# Altium project PIF_robot.PrjPcb
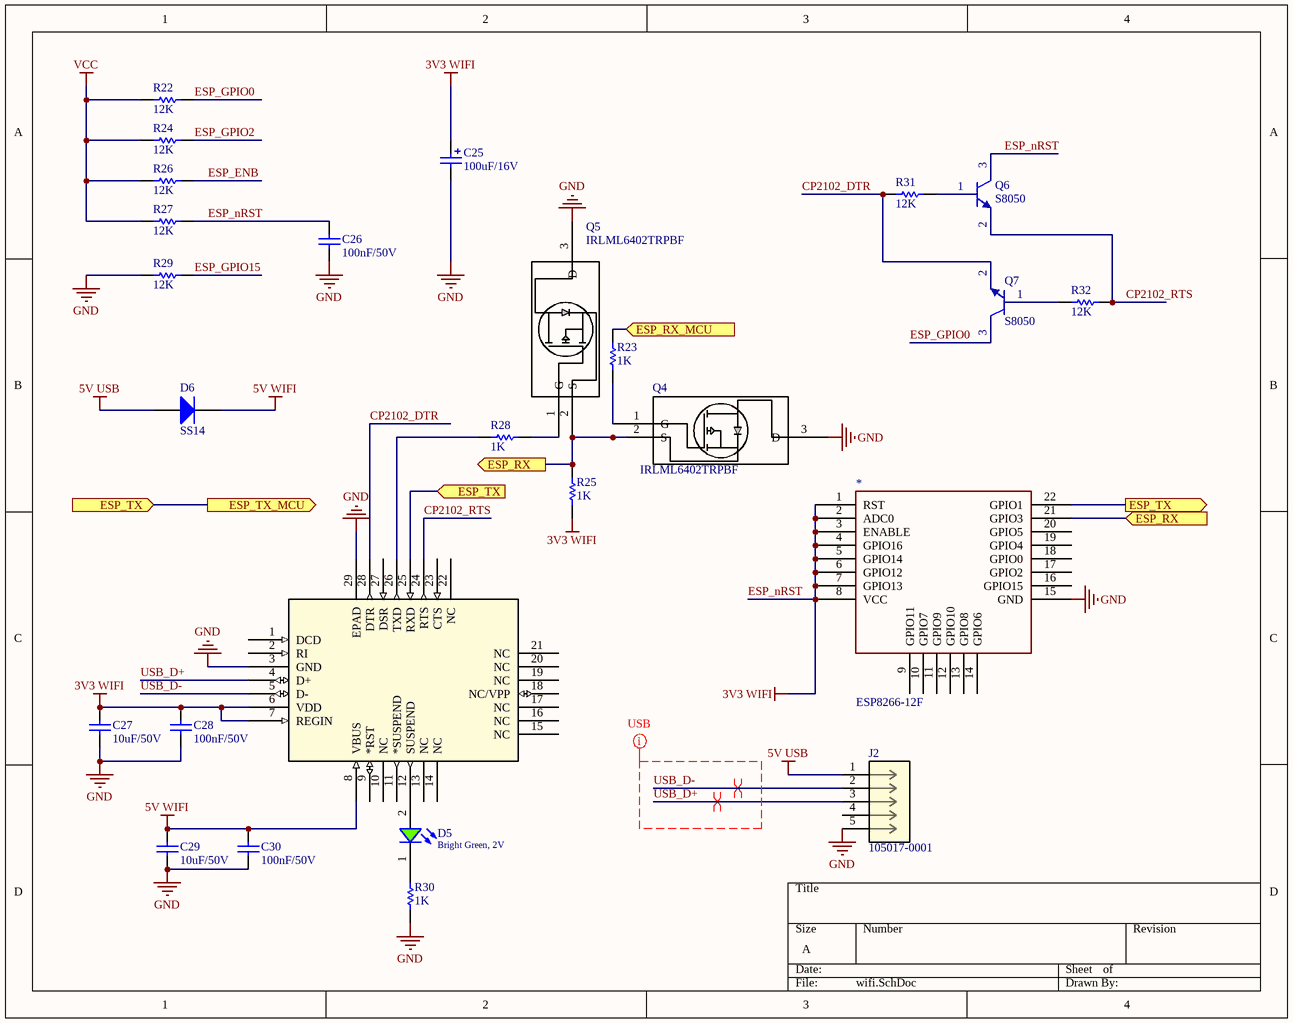
[diagram p0: wifi.SchDoc]
6 sheets, 91 parts. Net scope: flat (ports and power ports of the same name join across sheets).
Board file: PIF_robot.PcbDoc
Sheets:
  wifi.SchDoc
  Sensor.SchDoc
  RF.SchDoc
  Motor Control.SchDoc
  Decawave.schdoc
  MCU.schdoc

## Sheet wifi.SchDoc
size A

### Parts
*  ESP8266-12F  [ESP8266-12F]
?  (no value)  [QFN28_5X5_SIL]
C25  value 100uF/16V  [CAP_SM_TAN]  (hidden comment: TAJB107M006RNJ)
C26  value 100nF/50V  [CAP-SM-0805]  (hidden comment: Cap-100nF-50V-0805)
C27  value 10uF/50V  [CAP-SM-0805]  (hidden comment: Cap-10uF-50V-0805)
C28  value 100nF/50V  [CAP-SM-0805]  (hidden comment: Cap-100nF-50V-0805)
C29  value 10uF/50V  [CAP-SM-0805]  (hidden comment: Cap-10uF-50V-0805)
C30  value 100nF/50V  [CAP-SM-0805]  (hidden comment: Cap-100nF-50V-0805)
D5  Bright Green, 2V  [WL-SMCW_0805]
D6  SS14  [SS14]
J2  105017-0001  [CONN_105017-0001]
Q4  IRLML6402TRPBF  [SOT23_INF]
Q5  IRLML6402TRPBF  [SOT23_INF]
Q6  S8050  [SOT23_NEX]
Q7  S8050  [SOT23_NEX]
R22  value 12K  [RES-SM-0805]  (hidden comment: Res-12K-0805)
R23  value 1K  [RES-SM-0805]  (hidden comment: Res-1K-0805)
R24  value 12K  [RES-SM-0805]  (hidden comment: Res-12K-0805)
R25  value 1K  [RES-SM-0805]  (hidden comment: Res-1K-0805)
R26  value 12K  [RES-SM-0805]  (hidden comment: Res-12K-0805)
R27  value 12K  [RES-SM-0805]  (hidden comment: Res-12K-0805)
R28  value 1K  [RES-SM-0805]  (hidden comment: Res-1K-0805)
R29  value 12K  [RES-SM-0805]  (hidden comment: Res-12K-0805)
R30  value 1K  [RES-SM-0805]  (hidden comment: Res-1K-0805)
R31  value 12K  [RES-SM-0805]  (hidden comment: Res-12K-0805)
R32  value 12K  [RES-SM-0805]  (hidden comment: Res-12K-0805)

### Ports
ESP_RX (in), ESP_RX (out), ESP_RX_MCU (in), ESP_TX (in), ESP_TX (out), ESP_TX_MCU (out)

### Nets
5V USB: D6.2(A) J2.1
5V WIFI: ?.8(VBUS) C29.2 C30.2 D6.1(K)
ESP_nRST: *.1(RST) *.2(ADC0) *.3(ENABLE) *.4(GPIO16) *.5(GPIO14) *.6(GPIO12) *.7(GPIO13) *.8(VCC) ?.6(VDD) ?.7(REGIN) C25.1 C26.2 C27.2 C28.2 Q6.3(C) R25.1 R27.2  [also labelled 3V3 WIFI]
GND: *.15(GND) ?.3(GND) ?.29(EPAD) C25.2 C26.1 C27.1 C28.1 C29.1 C30.1 J2.5 Q4.3(D) Q5.3(D) R29.1 R30.1
VCC: R22.1 R24.1 R26.1 R27.1
CP2102_DTR: ?.28(DTR) Q7.2(E) R31.1
CP2102_RTS: ?.24(RTS) Q6.2(E) R32.2
ESP_ENB: R26.2
ESP_GPIO0: Q7.3(C) R22.2
ESP_GPIO2: R24.2
ESP_GPIO15: R29.2
USB_D+: ?.4(D+) J2.3
USB_D-: ?.5(D-) J2.2
Net*_21: *.21(GPIO3) Q4.2(S) Q5.2(S) R25.2 ; port ESP_RX
Net*_22: *.22(GPIO1) ?.25(RXD) ; port ESP_TX, port ESP_TX_MCU
Net?_12: ?.12(SUSPEND) D5.2(A)
Net?_26: ?.26(TXD) R28.1
NetD5_1: D5.1(K) R30.2
NetQ4_1: Q4.1(G) R23.2
NetQ5_1: Q5.1(G) R28.2
NetQ6_1: Q6.1(B) R31.2
NetQ7_1: Q7.1(B) R32.1
NetR23_1: R23.1 ; port ESP_RX_MCU

Not connected (* = marked no-connect by the designer): * 9(GPIO11) 10(GPIO7) 11(GPIO9) 12(GPIO10) 13(GPIO8) 14(GPIO6) 16(GPIO15) 17(GPIO2) 18(GPIO0) 19(GPIO4) 20(GPIO5); ? 1(DCD) 2(RI) 9(*RST) 10(NC) 11(*SUSPEND) 13(NC) 14(NC) 15(NC) 16(NC) 17(NC) 18(NC/VPP) 19(NC) 20(NC) 21(NC) 22(NC) 23(CTS) 27(DSR); J2 4

### Layout directives
differential pair: USB_D+, USB_D-
mark named USB: USB_D+, USB_D-

### Library data of the parts
? = CP2102-GM: No Description Available; Vendor: Silicon Labs; Built_By: EMA_UL_Team; SourceLibrary: Silicon_Labs_2015-03-23; Manufacturer_Part_Number: CP2102-GM; Copyright: Copyright (C) 2018 Accelerated Designs. All rights reserved; RefDes: RefDes; Type: DEV
C25 = Cap-Tan-100uF-16V: Manufacturer: Nichicon; Manufacturer Part Number: UWX1C101MCL1GB; Local Supplier: icdayroi; Local Supplier Link: https://icdayroi.com/tu-tantalum-100uf-16v-smd6032; Supplier 1: Digikey; Supplier 1 Part Number: 493-2105-1-ND; Supplier 1 Link: https://www.digikey.com/product-detail/en/nichicon/UWX1C101MCL1GB/493-2105-1-ND/590080
C26 C28 C30 = Cap-100nF-50V-0805: CAP CER 0.1UF 50V Y5V 0805; Manufacturer: Samsung Electro-Mechanics; Manufacturer Part Number: CL21F104ZBCNNNC; Local Supplier: thegioiic; Local Supplier Link: https://thegioiic.com/products/tu-100nf-0-1uf-50v-0805; Supplier 1: Digikey; Supplier 1 Part Number: 1276-1007-1-ND; Supplier 1 Link: https://www.digikey.com/product-detail/en/samsung-electro-mechanics/CL21F104ZBCNNNC/1276-1007-1-ND/3889093
C27 C29 = Cap-10uF-50V-0805: CAP CER 10UF 50V X5R 0805; Manufacturer: Yageo; Manufacturer Part Number: CC0805KKX5R9BB106; Local Supplier: thegioiic; Local Supplier Link: https://thegioiic.com/products/tu-10uf-50v-0805; Supplier 1: Digikey; Supplier 1 Link: https://www.digikey.com/product-detail/en/yageo/CC0805KKX5R9BB106/311-3499-2-ND/7164383; Supplier 1 Part Number: 311-3499-2-ND
D5 = 150080VS75000: WL-SMCW SMT Mono-color Chip LED Waterclear, size 0805, Bright Green, 2V, 140deg; Chip Technology: AlInGaP; Dominant Wavelength typ.: 570nm; Luminous Intensity typ.: 40mcd; Peak Wavelength typ.: 572nm; Viewing Angle: 140deg; ComponentLink1Description: Manufacturer; ComponentLink1URL: http://www.we-online.de; ComponentLink2URL: https://www.we-online.com/catalog/datasheet/150080VS75000.pdf; ComponentLink2Description: Datasheet; Forward Voltage typ.: 2V; Emitting Color: Bright Green; Mounting Technology: SMT; Operating Temperature: -40 to +85degC; Published Date: December 2019; Part Number: 150080VS75000; Packaging: Tape and Reel; Size: 0805; Publisher: Wurth Elektronik
D6 = Diode-SS14: DIODE SCHOTTKY 40V 1A SMA; Manufacturer: ON Semiconductor; Local Supplier: thegioiic; Local Supplier Link: https://thegioiic.com/products/ss14-sma; Supplier 1: Digikey; Supplier 1 Link: https://www.digikey.com/product-detail/en/on-semiconductor/SS14/SS14CT-ND/965729; Manufacturer Part Number: SS14; Supplier 1 Part Number: SS14CT-ND
J2 = 105017-0001: No Description Available; Vendor: Molex Connector Corporation; Built_By: EMA_Cory; SourceLibrary: Molex_2020-05-26; Datasheet: https://www.molex.com/pdm_docs/sd/1050170001_sd.pdf; Manufacturer_Part_Number: 105017-0001; Copyright: Copyright (C) 2018 Accelerated Designs. All rights reserved; RefDes: RefDes; Type: DEV
Q4 Q5 = IRLML6402TRPBF: No Description Available; Source_Library: Infineon_2020-02-27.xlr; Built_By: EMA_Justin; SourceLibrary: Infineon_2020-02-27; Vendor: Infineon; Type: DEV; Copyright: Copyright (C) 2018 Accelerated Designs. All rights reserved; Manufacturer_Part_Number: IRLML6402TRPBF; RefDes: RefDes
R22 R24 R26 R27 R29 R31 R32 = Res-12K-0805: RES 12 KOHM JUMPER 0805; Manufacturer: Vishay Thin Film; Manufacturer Part Number: PAT0805E3121BST1; Local Supplier: icdayroi; Local Supplier Link: https://icdayroi.com/dien-tro-12k-0805-1-goi-50-con; Supplier 1: Digikey; Supplier 1 Link: https://www.digikey.com/product-detail/en/vishay-thin-film/PAT0805E3121BST1/PAT0805E3121BST1-ND/2281536; Supplier 1 Part Number: PAT0805E3121BST1-ND
R23 R25 R28 R30 = Res-1K-0805: RES 1K OHM 1% 1/4W 0805; Manufacturer: Stackpole Electronics Inc; Manufacturer Part Number: RNCP0805FTD1K00; Local Supplier: thegioiic; Local Supplier Link: https://thegioiic.com/products/dien-tro-1k-ohm-0805-5; Supplier 1: Digikey; Supplier 1 Link: https://www.digikey.com/product-detail/en/stackpole-electronics-inc/RNCP0805FTD1K00/RNCP0805FTD1K00CT-ND/2240568; Supplier 1 Part Number: RNCP0805FTD1K00CT-ND
* = ESP8266-12F: Local Supplier: HShop; Local Supplier Link: https://hshop.vn/products/mach-thu-phat-wifi-soc-esp8266-v12; Local Supplier Part Number: HS000912; Manufacturer: *; Manufacturer Part Number: *

## Sheet Sensor.SchDoc
size A
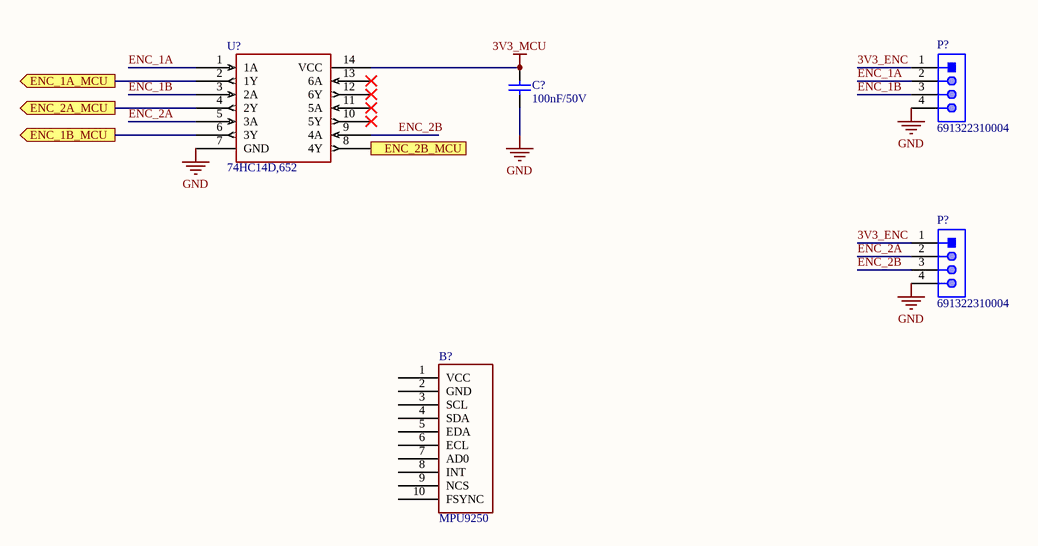
[diagram p1: Sensor.SchDoc]

### Parts
(Parts that share a designator on the sheet are numbered #1, #2 ... from top to bottom, then left to right.)
B?  MPU9250  [MPU9250]
C?#1  value 100nF/50V  [CAP-SM-0805]  (hidden comment: Cap-100nF-50V-0805)
P?#1  691322310004  [691322310004]
P?#2  691322310004  [691322310004]
U?#1  74HC14D,652  [SOT108-1_NEX]

### Ports
ENC_1A_MCU (out), ENC_1B_MCU (out), ENC_2A_MCU (out), ENC_2B_MCU (out)

### Nets
3V3_MCU: C?#1.2 U?#1.14(VCC)
GND: C?#1.1 P?#1.4 P?#2.4 U?#1.7(GND)
3V3_ENC: P?#1.1 P?#2.1
ENC_1A: P?#1.2 U?#1.1(1A)
ENC_1B: P?#1.3 U?#1.3(2A)
ENC_2A: P?#2.2 U?#1.5(3A)
ENC_2B: P?#2.3 U?#1.9(4A)
NetU?#1_2: U?#1.2(1Y) ; port ENC_1A_MCU
NetU?#1_4: U?#1.4(2Y) ; port ENC_2A_MCU
NetU?#1_6: U?#1.6(3Y) ; port ENC_1B_MCU
NetU?#1_8: U?#1.8(4Y) ; port ENC_2B_MCU

Not connected (* = marked no-connect by the designer): B? 1(VCC) 2(GND) 3(SCL) 4(SDA) 5(EDA) 6(ECL) 7(AD0) 8(INT) 9(NCS) 10(FSYNC); U?#1 10(5Y)* 11(5A)* 12(6Y)* 13(6A)*

### Library data of the parts
C?#1 = Cap-100nF-50V-0805: as C26 on sheet wifi; Local Supplier: thegioiic; Local Supplier Link: https://thegioiic.com/products/tu-100nf-0-1uf-50v-0805; Supplier 1: Digikey; Supplier 1 Part Number: 1276-1007-1-ND; Supplier 1 Link: https://www.digikey.com/product-detail/en/samsung-electro-mechanics/CL21F104ZBCNNNC/1276-1007-1-ND/3889093
P?#1 P?#2 = 691322310004: WR-TBL Serie 322 Horizontal PCB Header, Pluggable, pitch 3.81mm, 4p; Compliance: RoHS; Modularity: No; Pin Number: 4; Rated Current [UL]: 10A; Working Voltage [UL]: 300VAC; ComponentLink1Description: Manufacturer; ComponentLink1URL: http://www.we-online.de; ComponentLink2URL: https://katalog.we-online.de/em/datasheet/691322310004.pdf; ComponentLink2Description: Datasheet; Mounting Technology: THT; Part Number: 691322310004; Packaging: Box; Operating Temperature: -40 to +105degC; PCB/Cable/Panel: PCB; Pitch: 3.81mm; Published Date: October 2019; Type: Horizontal; Publisher: Wurth Elektronik; Application: Pluggable

## Sheet RF.SchDoc
size A
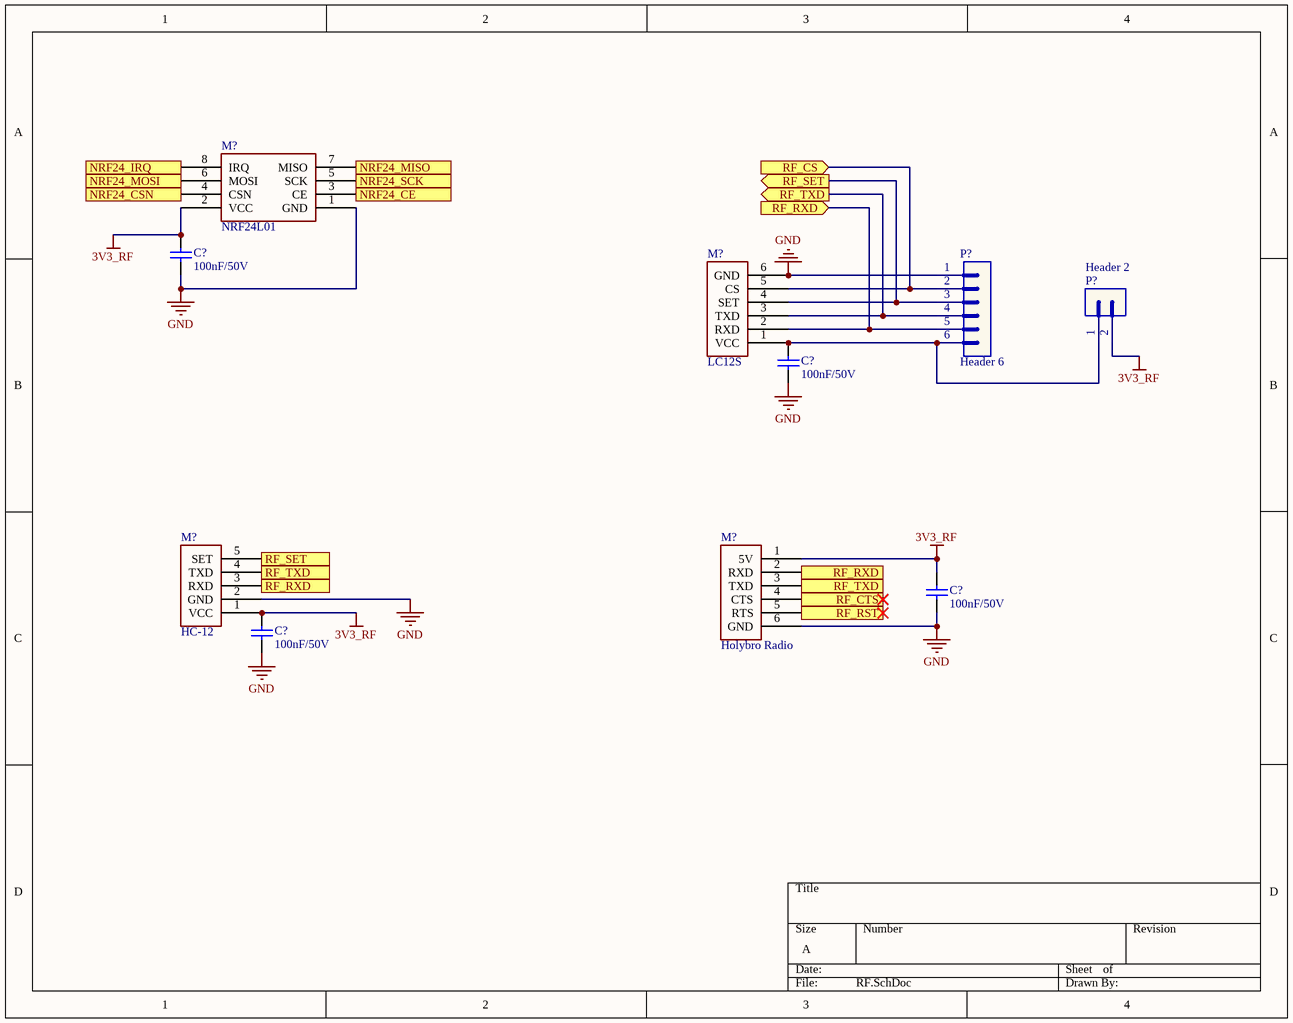
[diagram p2: RF.SchDoc]

### Parts
(Parts that share a designator on the sheet are numbered #1, #2 ... from top to bottom, then left to right.)
C?#2  value 100nF/50V  [CAP-SM-0805]  (hidden comment: Cap-100nF-50V-0805)
C?#3  value 100nF/50V  [CAP-SM-0805]  (hidden comment: Cap-100nF-50V-0805)
C?#4  value 100nF/50V  [CAP-SM-0805]  (hidden comment: Cap-100nF-50V-0805)
C?#5  value 100nF/50V  [CAP-SM-0805]  (hidden comment: Cap-100nF-50V-0805)
M?#1  NRF24L01  [NRF24L01]
M?#2  LC12S  [LC12S]
M?#3  HC-12  [HC-12]
M?#4  Holybro Radio  [Holybro-Radio]
P?#3  Header 6  [JP6]
P?#4  Header 2  [JP2]

### Ports
NRF24_CE (in), NRF24_CSN (in), NRF24_IRQ (out), NRF24_MISO (out), NRF24_MOSI (in), NRF24_SCK (in), RF_CS (in), RF_CTS (in), RF_RST (out), RF_RXD (in), RF_RXD (out), RF_SET (out), RF_TXD (in), RF_TXD (out)

### Nets
3V3_RF: C?#2.2 C?#4.2 C?#5.2 M?#1.2(VCC) M?#3.1(VCC) M?#4.1(5V) P?#4.2
GND: C?#2.1 C?#3.1 C?#4.1 C?#5.1 M?#1.1(GND) M?#2.6(GND) M?#3.2(GND) M?#4.6(GND) P?#3.1
NetC?#3_2: C?#3.2 M?#2.1(VCC) P?#3.6 P?#4.1
NetM?#1_3: M?#1.3(CE) ; port NRF24_CE
NetM?#1_4: M?#1.4(CSN) ; port NRF24_CSN
NetM?#1_5: M?#1.5(SCK) ; port NRF24_SCK
NetM?#1_6: M?#1.6(MOSI) ; port NRF24_MOSI
NetM?#1_7: M?#1.7(MISO) ; port NRF24_MISO
NetM?#1_8: M?#1.8(IRQ) ; port NRF24_IRQ
NetM?#2_2: M?#2.2(RXD) M?#3.3(RXD) M?#4.2(RXD) P?#3.5 ; port RF_RXD
NetM?#2_3: M?#2.3(TXD) M?#3.4(TXD) M?#4.3(TXD) P?#3.4 ; port RF_TXD
NetM?#2_4: M?#2.4(SET) M?#3.5(SET) P?#3.3 ; port RF_SET
NetM?#2_5: M?#2.5(CS) P?#3.2 ; port RF_CS
NetM?#4_4: M?#4.4(CTS) ; port RF_CTS
NetM?#4_5: M?#4.5(RTS) ; port RF_RST

### Library data of the parts
C?#2-C?#5 = Cap-100nF-50V-0805: as C26 on sheet wifi; Local Supplier: thegioiic; Local Supplier Link: https://thegioiic.com/products/tu-100nf-0-1uf-50v-0805; Supplier 1: Digikey; Supplier 1 Part Number: 1276-1007-1-ND; Supplier 1 Link: https://www.digikey.com/product-detail/en/samsung-electro-mechanics/CL21F104ZBCNNNC/1276-1007-1-ND/3889093
P?#3 = Header 6: Header, 6-Pin; LatestRevisionDate: 17-Jul-2002; LatestRevisionNote: Re-released for DXP Platform.; Publisher: Altium Limited
P?#4 = Header 2: Header, 2-Pin; LatestRevisionDate: 17-Jul-2002; LatestRevisionNote: Re-released for DXP Platform.; Publisher: Altium Limited
M?#1 = NRF24L01: Local Supplier Link: https://hshop.vn/products/mach-thu-phat-nrf24l01-pa-2-4ghzcu-khech-dai-cung-suat-thu-phat; Local Supplier: HShop; Local Supplier Part Number: HS000888; Manufacturer: *; Manufacturer Part Number: *
M?#2 = LC12S: Local Supplier Link: https://hshop.vn/products/mach-thu-phat-rf-uart-lc12s-2-4ghz?fbclid=IwAR3h1hU0io-Cc4GBL9Q-KMB_-TKtvE-b63OAEmRNHthVrXHliy_JpDId3Yg; Local Supplier: HShop; Local Supplier Part Number: HS00095; Manufacturer: *; Manufacturer Part Number: *
M?#3 = HC-12: Local Supplier: HShop; Local Supplier Link: https://hshop.vn/products/mach-thu-phat-rf-uart-si4463-433mhzkhoang-coch-1km; Local Supplier Part Number: HS000897; Manufacturer: *; Manufacturer Part Number: *
M?#4 = Holybro Radio: Local Supplier: *; Local Supplier Link: https://www.lazada.vn/products/ld-holybro-433mhz-915-mhz-500-mw-thu-phat-vo-tuyen-xa-bo-v3-cho-pixhawk-4-dieu-khien-chuyen-bay-i430804435-s768474304.html?spm=a2o4n.searchlist.list.4.25396b19yIS9XO&search=1; Local Supplier Part Number: *; Manufacturer: *; Manufacturer Part Number: *

## Sheet Motor Control.SchDoc
size A
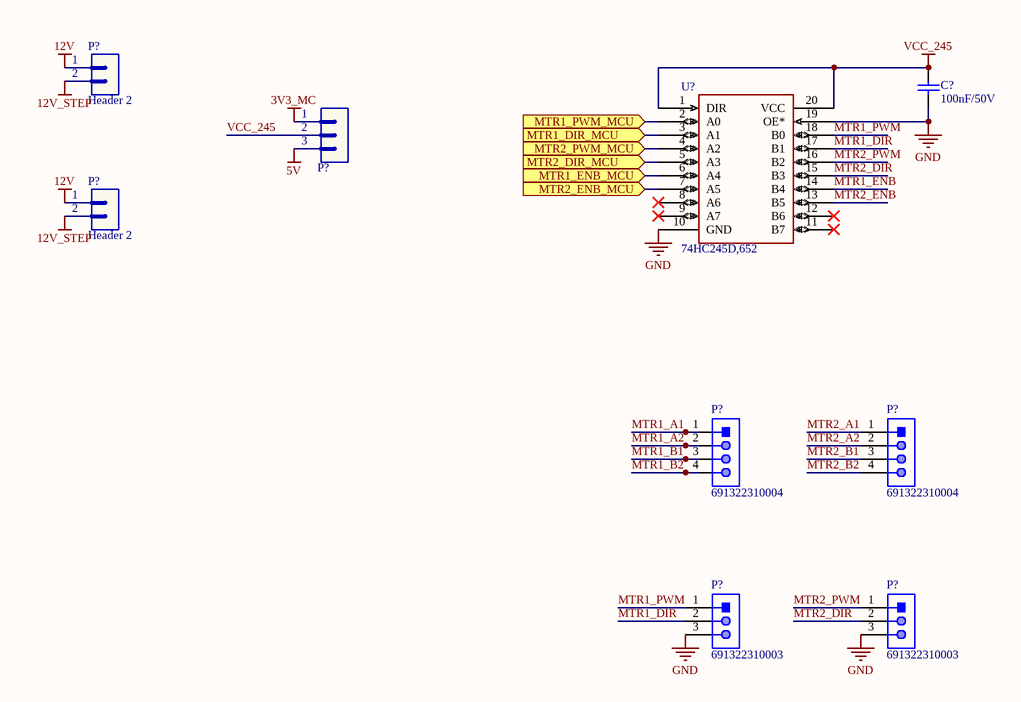
[diagram p3: Motor Control.SchDoc]

### Parts
(Parts that share a designator on the sheet are numbered #1, #2 ... from top to bottom, then left to right.)
C?#6  value 100nF/50V  [CAP-SM-0805]  (hidden comment: Cap-100nF-50V-0805)
P?#5  Header 2  [JP2]
P?#6  Header 3  [JP3]  (value not drawn)
P?#7  Header 2  [JP2]
P?#8  691322310004  [691322310004]
P?#9  691322310004  [691322310004]
P?#10  691322310003  [691322310003]
P?#11  691322310003  [691322310003]
U?#2  74HC245D,652  [SOT163-1_NEX]

### Ports
MTR1_DIR_MCU (in), MTR1_ENB_MCU (in), MTR1_PWM_MCU (in), MTR2_DIR_MCU (in), MTR2_ENB_MCU (in), MTR2_PWM_MCU (in)

### Nets
3V3_MC: P?#6.1
5V: P?#6.3
12V: P?#5.1 P?#7.1
12V_STEP: P?#5.2 P?#7.2
GND: C?#6.1 P?#10.3 P?#11.3 U?#2.10(GND) U?#2.19(OE*)
VCC_245: C?#6.2 P?#6.2 U?#2.1(DIR) U?#2.20(VCC)
MTR1_A1: P?#8.1
MTR1_A2: P?#8.2
MTR1_B1: P?#8.3
MTR1_B2: P?#8.4
MTR1_DIR: P?#10.2 U?#2.17(B1)
MTR1_ENB: U?#2.14(B4)
MTR1_PWM: P?#10.1 U?#2.18(B0)
MTR2_A1: P?#9.1
MTR2_A2: P?#9.2
MTR2_B1: P?#9.3
MTR2_B2: P?#9.4
MTR2_DIR: P?#11.2 U?#2.15(B3)
MTR2_ENB: U?#2.13(B5)
MTR2_PWM: P?#11.1 U?#2.16(B2)
NetU?#2_2: U?#2.2(A0) ; port MTR1_PWM_MCU
NetU?#2_3: U?#2.3(A1) ; port MTR1_DIR_MCU
NetU?#2_4: U?#2.4(A2) ; port MTR2_PWM_MCU
NetU?#2_5: U?#2.5(A3) ; port MTR2_DIR_MCU
NetU?#2_6: U?#2.6(A4) ; port MTR1_ENB_MCU
NetU?#2_7: U?#2.7(A5) ; port MTR2_ENB_MCU

Not connected (* = marked no-connect by the designer): U?#2 8(A6)* 9(A7)* 11(B7)* 12(B6)*

### Library data of the parts
C?#6 = Cap-100nF-50V-0805: as C26 on sheet wifi; Local Supplier: thegioiic; Local Supplier Link: https://thegioiic.com/products/tu-100nf-0-1uf-50v-0805; Supplier 1: Digikey; Supplier 1 Part Number: 1276-1007-1-ND; Supplier 1 Link: https://www.digikey.com/product-detail/en/samsung-electro-mechanics/CL21F104ZBCNNNC/1276-1007-1-ND/3889093
P?#5 P?#7 = Header 2: Header, 2-Pin; LatestRevisionDate: 17-Jul-2002; LatestRevisionNote: Re-released for DXP Platform.; Publisher: Altium Limited
P?#6 = Header 3: Header, 3-Pin; LatestRevisionDate: 17-Jul-2002; LatestRevisionNote: Re-released for DXP Platform.; Publisher: Altium Limited
P?#8 P?#9 = 691322310004: as P?#1 on sheet Sensor; ComponentLink1Description: Manufacturer; ComponentLink1URL: http://www.we-online.de; ComponentLink2URL: https://katalog.we-online.de/em/datasheet/691322310004.pdf; ComponentLink2Description: Datasheet; Mounting Technology: THT; Part Number: 691322310004; Packaging: Box; Operating Temperature: -40 to +105degC; PCB/Cable/Panel: PCB; Pitch: 3.81mm; Published Date: October 2019; Type: Horizontal; Publisher: Wurth Elektronik; Application: Pluggable
P?#10 P?#11 = 691322310003: WR-TBL Serie 322 Horizontal PCB Header, Pluggable, pitch 3.81mm, 3p; Compliance: RoHS; Modularity: No; Pin Number: 3; Rated Current [UL]: 10A; Working Voltage [UL]: 300VAC; ComponentLink1Description: Manufacturer; ComponentLink1URL: http://www.we-online.de; ComponentLink2URL: https://katalog.we-online.de/em/datasheet/691322310003.pdf; ComponentLink2Description: Datasheet; Mounting Technology: THT; Part Number: 691322310003; Packaging: Box; Operating Temperature: -40 to +105degC; PCB/Cable/Panel: PCB; Pitch: 3.81mm; Published Date: October 2019; Type: Horizontal; Publisher: Wurth Elektronik; Application: Pluggable

## Sheet Decawave.schdoc
size A
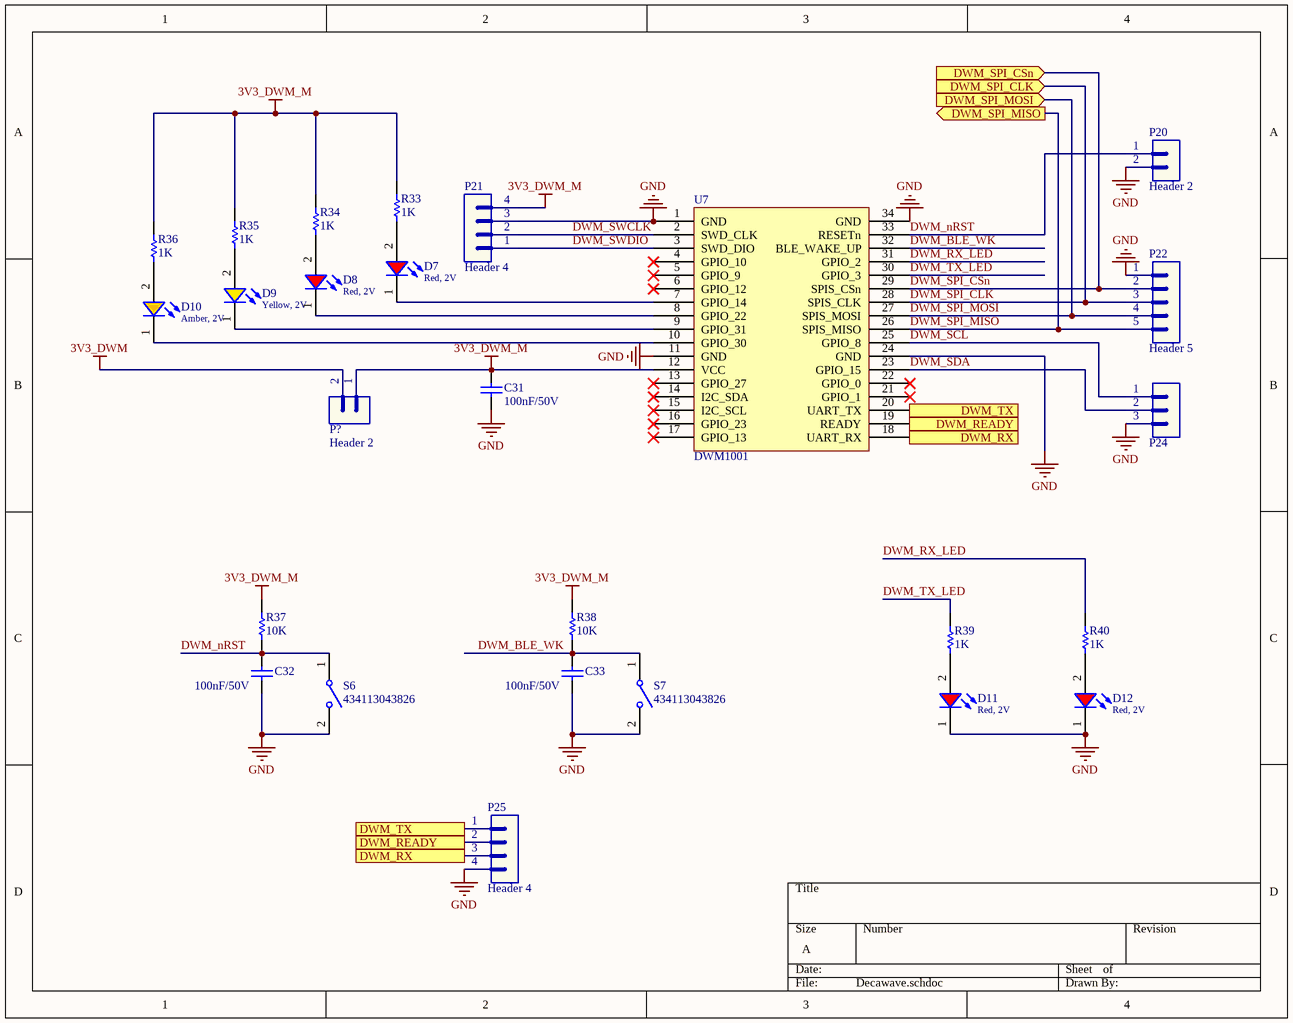
[diagram p4: Decawave.schdoc]

### Parts
(Parts that share a designator on the sheet are numbered #1, #2 ... from top to bottom, then left to right.)
C31  value 100nF/50V  [CAP-SM-0805]  (hidden comment: Cap-100nF-50V-0805)
C32  value 100nF/50V  [CAP-SM-0805]  (hidden comment: Cap-100nF-50V-0805)
C33  value 100nF/50V  [CAP-SM-0805]  (hidden comment: Cap-100nF-50V-0805)
D7  Red, 2V  [WL-SMCW_0805]
D8  Red, 2V  [WL-SMCW_0805]
D9  Yellow, 2V  [WL-SMCW_0805]
D10  Amber, 2V  [WL-SMCW_0805]
D11  Red, 2V  [WL-SMCW_0805]
D12  Red, 2V  [WL-SMCW_0805]
P20  Header 2  [JP2]
P21  Header 4  [JP4]
P22  Header 5  [JP5]
P24  Header 3  [JP3]  (value not drawn)
P25  Header 4  [JP4]
P?#12  Header 2  [JP2]
R33  value 1K  [RES-SM-0805]  (hidden comment: Res-1K-0805)
R34  value 1K  [RES-SM-0805]  (hidden comment: Res-1K-0805)
R35  value 1K  [RES-SM-0805]  (hidden comment: Res-1K-0805)
R36  value 1K  [RES-SM-0805]  (hidden comment: Res-1K-0805)
R37  value 10K  [RES-SM-0805]  (hidden comment: Res-10k-0805)
R38  value 10K  [RES-SM-0805]  (hidden comment: Res-10k-0805)
R39  value 1K  [RES-SM-0805]  (hidden comment: Res-1K-0805)
R40  value 1K  [RES-SM-0805]  (hidden comment: Res-1K-0805)
S6  434113043826  [434113043826]
S7  434113043826  [434113043826]
U7  DWM1001

### Ports
DWM_READY (in), DWM_READY (out), DWM_RX (in), DWM_RX (out), DWM_SPI_CLK (in), DWM_SPI_CSn (in), DWM_SPI_MISO (out), DWM_SPI_MOSI (in), DWM_TX (in), DWM_TX (out)

### Nets
3V3_DWM: P?#12.2
3V3_DWM_M: C31.2 P21.4 P?#12.1 R33.2 R34.2 R35.2 R36.2 R37.2 R38.2 U7.12(VCC)
GND: C31.1 C32.2 C33.2 D11.1(K) D12.1(K) P20.2 P21.3 P22.1 P24.3 P25.4 S6.2 S7.2 U7.1(GND) U7.11(GND) U7.24(GND) U7.34(GND)
DWM_BLE_WK: C33.1 R38.1 S7.1 U7.32(BLE_WAKE_UP)
DWM_nRST: C32.1 P20.1 R37.1 S6.1 U7.33(RESETn)
DWM_RX_LED: R40.2 U7.31(GPIO_2)
DWM_SCL: P24.1 U7.25(GPIO_8)
DWM_SDA: P24.2 U7.23(GPIO_15)
DWM_SPI_CLK: P22.3 U7.28(SPIS_CLK) ; port DWM_SPI_CLK
DWM_SPI_CSn: P22.2 U7.29(SPIS_CSn) ; port DWM_SPI_CSn
DWM_SPI_MISO: P22.5 U7.26(SPIS_MISO) ; port DWM_SPI_MISO
DWM_SPI_MOSI: P22.4 U7.27(SPIS_MOSI) ; port DWM_SPI_MOSI
DWM_SWCLK: P21.2 U7.2(SWD_CLK)
DWM_SWDIO: P21.1 U7.3(SWD_DIO)
DWM_TX_LED: R39.2 U7.30(GPIO_3)
NetD7_1: D7.1(K) U7.7(GPIO_14)
NetD7_2: D7.2(A) R33.1
NetD8_1: D8.1(K) U7.8(GPIO_22)
NetD8_2: D8.2(A) R34.1
NetD9_1: D9.1(K) U7.9(GPIO_31)
NetD9_2: D9.2(A) R35.1
NetD10_1: D10.1(K) U7.10(GPIO_30)
NetD10_2: D10.2(A) R36.1
NetD11_2: D11.2(A) R39.1
NetD12_2: D12.2(A) R40.1
NetP25_1: P25.1 U7.20(UART_TX) ; port DWM_TX
NetP25_2: P25.2 U7.19(READY) ; port DWM_READY
NetP25_3: P25.3 U7.18(UART_RX) ; port DWM_RX

Not connected (* = marked no-connect by the designer): U7 4(GPIO_10)* 5(GPIO_9)* 6(GPIO_12)* 13(GPIO_27)* 14(I2C_SDA)* 15(I2C_SCL)* 16(GPIO_23)* 17(GPIO_13)* 21(GPIO_1)* 22(GPIO_0)*

### Library data of the parts
C31-C33 = Cap-100nF-50V-0805: as C26 on sheet wifi; Local Supplier: thegioiic; Local Supplier Link: https://thegioiic.com/products/tu-100nf-0-1uf-50v-0805; Supplier 1: Digikey; Supplier 1 Part Number: 1276-1007-1-ND; Supplier 1 Link: https://www.digikey.com/product-detail/en/samsung-electro-mechanics/CL21F104ZBCNNNC/1276-1007-1-ND/3889093
D7 D8 D11 D12 = 150080RS75000: WL-SMCW SMT Mono-color Chip LED Waterclear, size 0805, Red, 2V, 140deg; Chip Technology: AlInGaP; Dominant Wavelength typ.: 625nm; Luminous Intensity typ.: 150mcd; Peak Wavelength typ.: 630nm; Viewing Angle: 140deg; ComponentLink1Description: Manufacturer; ComponentLink1URL: http://www.we-online.de; ComponentLink2URL: https://www.we-online.com/catalog/datasheet/150080RS75000.pdf; ComponentLink2Description: Datasheet; Forward Voltage typ.: 2V; Emitting Color: Red; Mounting Technology: SMT; Operating Temperature: -40 to +85degC; Published Date: December 2019; Part Number: 150080RS75000; Packaging: Tape and Reel; Size: 0805; Publisher: Wurth Elektronik
D9 = 150080YS75000: WL-SMCW SMT Mono-color Chip LED Waterclear, size 0805, Yellow, 2V, 140deg; Chip Technology: AlInGaP; Dominant Wavelength typ.: 590nm; Luminous Intensity typ.: 120mcd; Peak Wavelength typ.: 595nm; Viewing Angle: 140deg; ComponentLink1Description: Manufacturer; ComponentLink1URL: http://www.we-online.de; ComponentLink2URL: https://www.we-online.com/catalog/datasheet/150080YS75000.pdf; ComponentLink2Description: Datasheet; Forward Voltage typ.: 2V; Emitting Color: Yellow; Mounting Technology: SMT; Operating Temperature: -40 to +85degC; Published Date: December 2019; Part Number: 150080YS75000; Packaging: Tape and Reel; Size: 0805; Publisher: Wurth Elektronik
D10 = 150080AS75000: WL-SMCW SMT Mono-color Chip LED Waterclear, size 0805, Amber, 2V, 140deg; Chip Technology: AlInGaP; Dominant Wavelength typ.: 605nm; Luminous Intensity typ.: 130mcd; Peak Wavelength typ.: 610nm; Viewing Angle: 140deg; ComponentLink1Description: Manufacturer; ComponentLink1URL: http://www.we-online.de; ComponentLink2URL: https://www.we-online.com/catalog/datasheet/150080AS75000.pdf; ComponentLink2Description: Datasheet; Forward Voltage typ.: 2V; Emitting Color: Amber; Mounting Technology: SMT; Operating Temperature: -40 to +85degC; Published Date: December 2019; Part Number: 150080AS75000; Packaging: Tape and Reel; Size: 0805; Publisher: Wurth Elektronik
P20 P?#12 = Header 2: Header, 2-Pin; LatestRevisionDate: 17-Jul-2002; LatestRevisionNote: Re-released for DXP Platform.; Publisher: Altium Limited
P21 P25 = Header 4: Header, 4-Pin; LatestRevisionDate: 17-Jul-2002; LatestRevisionNote: Re-released for DXP Platform.; Publisher: Altium Limited
P22 = Header 5: Header, 5-Pin; LatestRevisionDate: 17-Jul-2002; LatestRevisionNote: Re-released for DXP Platform.; Publisher: Altium Limited
P24 = Header 3: Header, 3-Pin; LatestRevisionDate: 17-Jul-2002; LatestRevisionNote: Re-released for DXP Platform.; Publisher: Altium Limited
R33-R36 R39 R40 = Res-1K-0805: as R23 on sheet wifi; Local Supplier: thegioiic; Local Supplier Link: https://thegioiic.com/products/dien-tro-1k-ohm-0805-5; Supplier 1: Digikey; Supplier 1 Link: https://www.digikey.com/product-detail/en/stackpole-electronics-inc/RNCP0805FTD1K00/RNCP0805FTD1K00CT-ND/2240568; Supplier 1 Part Number: RNCP0805FTD1K00CT-ND
R37 R38 = Res-10k-0805: RES 10K OHM 1% 1/4W 0805; Manufacturer: Stackpole Electronics Inc; Manufacturer Part Number: RNCP0805FTD10K0; Local Supplier: thegioiic; Local Supplier Link: https://thegioiic.com/products/dien-tro-10k-ohm-0805-5; Supplier 1: Digikey; Supplier 1 Link: https://www.digikey.com/product-detail/en/stackpole-electronics-inc/RNCP0805FTD10K0/RNCP0805FTD10K0CT-ND/2240601; Supplier 1 Part Number: RNCP0805FTD10K0CT-ND
S6 S7 = 434113043826: WS-TASV J-Bend SMT Tact Switch 6x3.5mm, height 4.3mm, 260gf; Rated Voltage: 12VDC; Rated Current: 50mA; Washable: No; ComponentLink1Description: Manufacturer; ComponentLink1URL: http://www.we-online.de; ComponentLink2Description: Datasheet; ComponentLink2URL: https://katalog.we-online.com/em/datasheet/434113043826.pdf; Operating Temperature: -40 to +85degC; Part Number: 434113043826; Published Date: September 2019; Contact Material: Stainless Steel; Height: 4.3mm; Mounting Technology: SMT; Contact Plating: Silver; Operation Force: 260gf; Packaging: Tape and Reel; Terminal Material: Copper Alloy; Publisher: Wurth Elektronik; Terminal Plating: Silver

## Sheet MCU.schdoc
size A
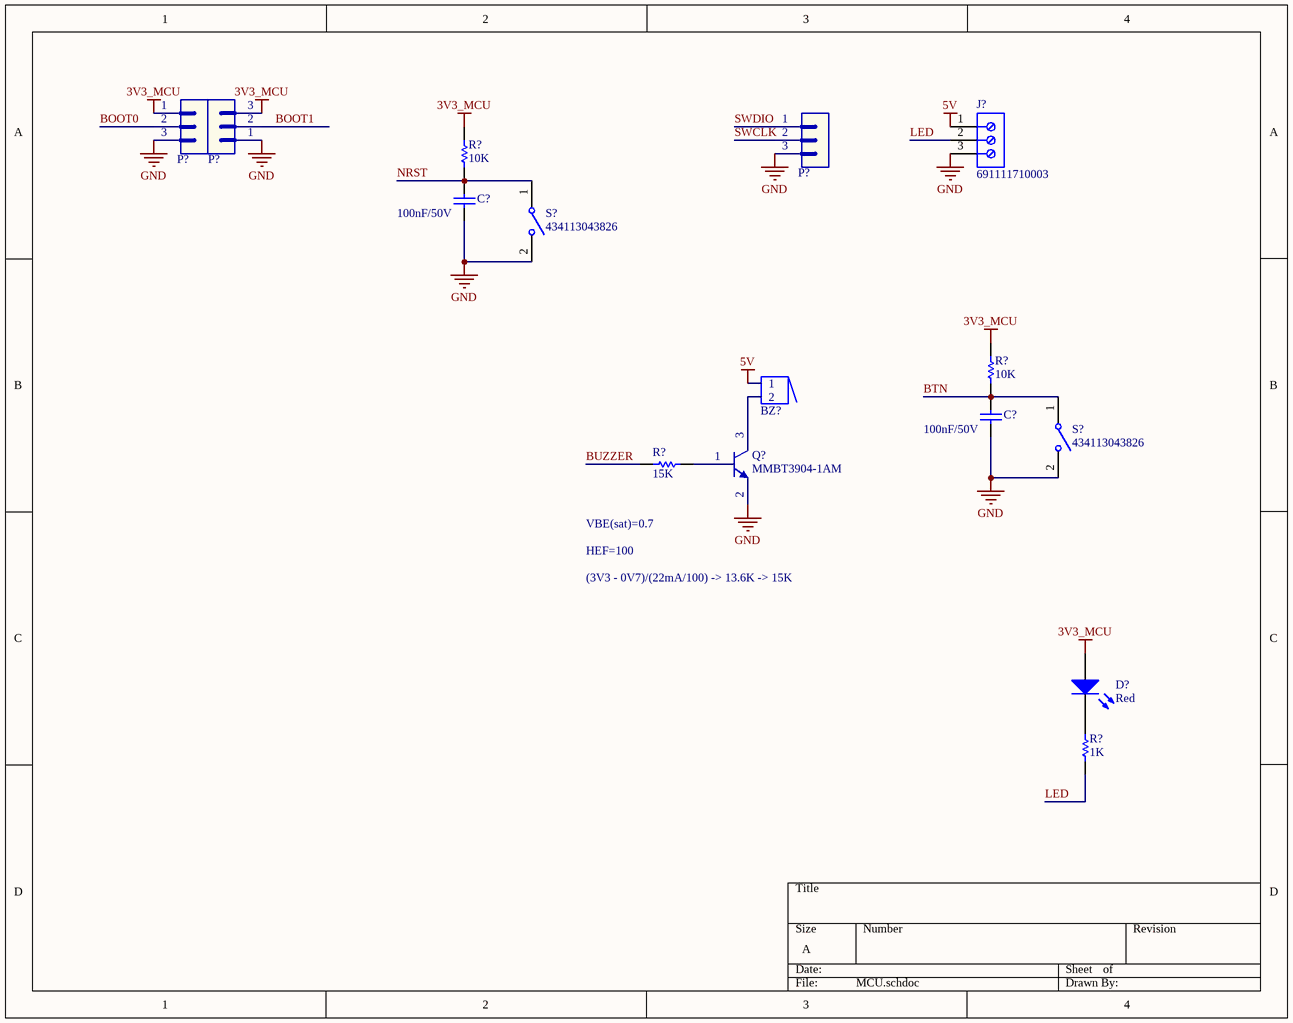
[diagram p5: MCU.schdoc]

### Parts
(Parts that share a designator on the sheet are numbered #1, #2 ... from top to bottom, then left to right.)
BZ?  Buzzer  [BUZZER]  (value not drawn)
C?#7  value 100nF/50V  [CAP-SM-0805]  (hidden comment: Cap-100nF-50V-0805)
C?#8  value 100nF/50V  [CAP-SM-0805]  (hidden comment: Cap-100nF-50V-0805)
D?  value Red  [LED-3mm]  (hidden comment: LED-RED-TH-3mm)
J?  691111710003  [691111710003]
P?#13  Header 3  [JP3]  (value not drawn)
P?#14  Header 3  [JP3]  (value not drawn)
P?#15  Header 3  [JP3]  (value not drawn)
Q?  MMBT3904-1AM  [SOT23_NEX]
R?#1  value 10K  [RES-SM-0805]  (hidden comment: Res-10k-0805)
R?#2  value 10K  [RES-SM-0805]  (hidden comment: Res-10k-0805)
R?#3  value 15K  [RES-SM-0805]  (hidden comment: Res-15K-0805)
R?#4  value 1K  [RES-SM-0805]  (hidden comment: Res-1K-0805)
S?#1  434113043826  [434113043826]
S?#2  434113043826  [434113043826]

### Nets
3V3_MCU: D?.1(A) P?#13.1 P?#15.3 R?#1.1 R?#2.1
5V: BZ?.1 J?.1
GND: C?#7.1 C?#8.1 J?.3 P?#13.3 P?#14.3 P?#15.1 Q?.2(E) S?#1.2 S?#2.2
BOOT0: P?#13.2
BOOT1: P?#15.2
BTN: C?#8.2 R?#2.2 S?#2.1
BUZZER: R?#3.1
LED: J?.2 R?#4.1
NRST: C?#7.2 R?#1.2 S?#1.1
SWCLK: P?#14.2
SWDIO: P?#14.1
NetBZ?_2: BZ?.2 Q?.3(C)
NetD?_2: D?.2(K) R?#4.2
NetQ?_1: Q?.1(B) R?#3.2

### Notes on the sheet
- VBE(sat)=0.7
- HEF=100
- (3V3 - 0V7)/(22mA/100) -> 13.6K -> 15K

### Library data of the parts
C?#7 C?#8 = Cap-100nF-50V-0805: as C26 on sheet wifi; Local Supplier: thegioiic; Local Supplier Link: https://thegioiic.com/products/tu-100nf-0-1uf-50v-0805; Supplier 1: Digikey; Supplier 1 Part Number: 1276-1007-1-ND; Supplier 1 Link: https://www.digikey.com/product-detail/en/samsung-electro-mechanics/CL21F104ZBCNNNC/1276-1007-1-ND/3889093
D? = LED-RED-TH-3mm: LED RED CLEAR T-1 T/H; Manufacturer: Kingbright; Manufacturer Part Number: WP710A10SEC/J3; Local Supplier: thegioiic; Local Supplier Link: https://thegioiic.com/products/led-do-3mm-chan-dai; Supplier 1: Digikey; Supplier 1 Link: https://www.digikey.com/product-detail/en/kingbright/WP710A10SEC-J3/754-1589-ND/2769815; Supplier 1 Part Number: 754-1589-ND
J? = 691111710003: WR-TBL Serie 111 Horizontal Entry Modular, Pressure Clamp, pitch 5mm, 3p; Compliance: Lead free / RoHS; Modularity: Yes; PCB/Cable/Panel: PCB; Pin Number: 3; Rated Current [UL]: 15A; Working Voltage [UL]: 250VAC; ComponentLink1Description: Manufacturer; ComponentLink1URL: http://www.we-online.de; ComponentLink2URL: https://katalog.we-online.de/em/datasheet/691111710003.pdf; ComponentLink2Description: Datasheet; Mounting Technology: THT; Part Number: 691111710003; Packaging: Box; Operating Temperature: -40 to +105degC; Pitch: 5mm; Published Date: October 2019; Type: Horizontal; Publisher: Wurth Elektronik; Application: Pressure Clamp
P?#13-P?#15 = Header 3: Header, 3-Pin; LatestRevisionDate: 17-Jul-2002; LatestRevisionNote: Re-released for DXP Platform.; Publisher: Altium Limited
R?#1 R?#2 = Res-10k-0805: as R37 on sheet Decawave; Local Supplier: thegioiic; Local Supplier Link: https://thegioiic.com/products/dien-tro-10k-ohm-0805-5; Supplier 1: Digikey; Supplier 1 Link: https://www.digikey.com/product-detail/en/stackpole-electronics-inc/RNCP0805FTD10K0/RNCP0805FTD10K0CT-ND/2240601; Supplier 1 Part Number: RNCP0805FTD10K0CT-ND
R?#3 = Res-15K-0805: RES 15K OHM 1% 1/4W 0805; Manufacturer: TE Connectivity Passive Product; Manufacturer Part Number: CRGCQ0805F15K; Local Supplier: thegioiic; Local Supplier Link: https://thegioiic.com/products/dien-tro-15k-ohm-0805-1; Supplier 1: Digikey; Supplier 1 Part Number: A129763CT-ND; Supplier 1 Link: https://www.digikey.com/product-detail/en/te-connectivity-passive-product/CRGCQ0805F15K/A129763CT-ND/8577595
R?#4 = Res-1K-0805: as R23 on sheet wifi; Local Supplier: thegioiic; Local Supplier Link: https://thegioiic.com/products/dien-tro-1k-ohm-0805-5; Supplier 1: Digikey; Supplier 1 Link: https://www.digikey.com/product-detail/en/stackpole-electronics-inc/RNCP0805FTD1K00/RNCP0805FTD1K00CT-ND/2240568; Supplier 1 Part Number: RNCP0805FTD1K00CT-ND
S?#1 S?#2 = 434113043826: as S6 on sheet Decawave; ComponentLink1Description: Manufacturer; ComponentLink1URL: http://www.we-online.de; ComponentLink2Description: Datasheet; ComponentLink2URL: https://katalog.we-online.com/em/datasheet/434113043826.pdf; Operating Temperature: -40 to +85degC; Part Number: 434113043826; Published Date: September 2019; Contact Material: Stainless Steel; Height: 4.3mm; Mounting Technology: SMT; Contact Plating: Silver; Operation Force: 260gf; Packaging: Tape and Reel; Terminal Material: Copper Alloy; Publisher: Wurth Elektronik; Terminal Plating: Silver

## Nets that join several sheets
3V3_MCU: Sensor (C?#1.2 U?#1.14), MCU (5 pins)
5V: Motor Control (P?#6.3), MCU (BZ?.1 J?.1)
GND: wifi (14 pins), Sensor (C?#1.1 P?#1.4 P?#2.4 U?#1.7), RF (9 pins), Motor Control (5 pins), Decawave (16 pins), MCU (9 pins)